# EAGLE schematic Control board (EAGLE 9.6.2)
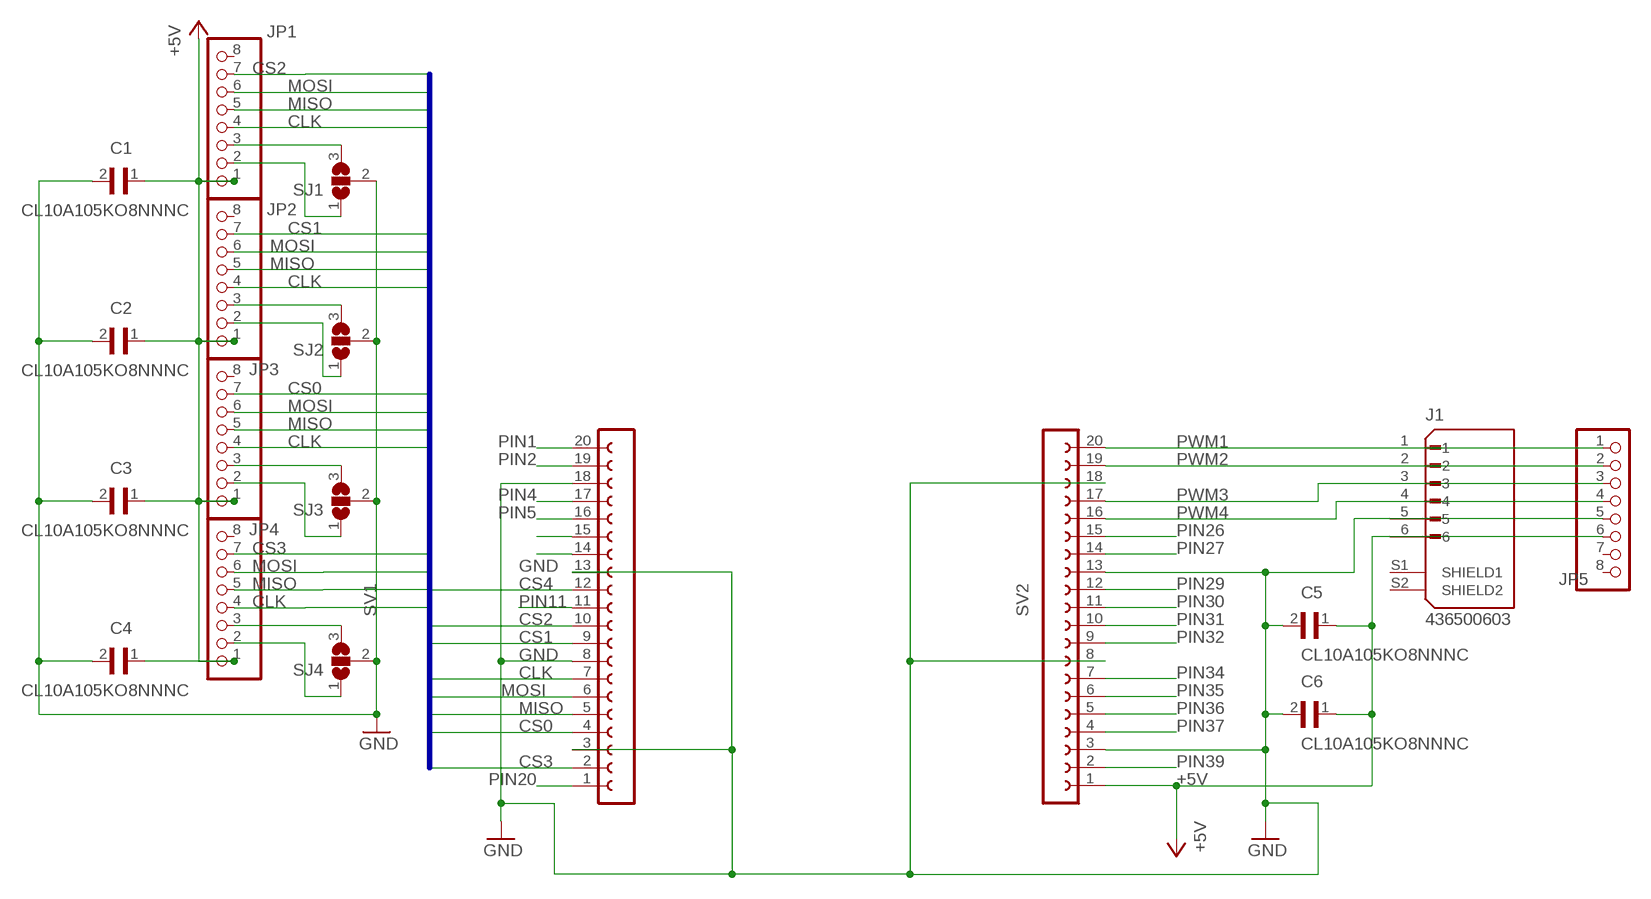
[diagram p0: schematic, sheet 1]

## Parts
C1  CL10A105KO8NNNC  [CAPC1608X90N]
C2  CL10A105KO8NNNC  [CAPC1608X90N]
C3  CL10A105KO8NNNC  [CAPC1608X90N]
C4  CL10A105KO8NNNC  [CAPC1608X90N]
C5  CL10A105KO8NNNC  [CAPC1608X90N]
C6  CL10A105KO8NNNC  [CAPC1608X90N]
J1  436500603  [MOLEX_436500603]
JP1  PINHD-1X81X08/FE  [HDRVR8W64P254_1X8_2159X200X810B]
JP2  PINHD-1X81X08/FE  [HDRVR8W64P254_1X8_2159X200X810B]
JP3  PINHD-1X81X08/FE  [HDRVR8W64P254_1X8_2159X200X810B]
JP4  PINHD-1X81X08/FE  [HDRVR8W64P254_1X8_2159X200X810B]
JP5  PINHD-1X81X08/FE  [HDRVR8W64P254_1X8_2159X200X810B]
SJ1  SJ2W  [SJ_2]
SJ2  SJ2W  [SJ_2]
SJ3  SJ2W  [SJ_2]
SJ4  SJ2W  [SJ_2]
SV1  FE20-1  [FE20]
SV2  FE20-1  [FE20]

## Nets
+5V: C1.1 C2.1 C3.1 C4.1 C5.1 C6.1 J1.6 JP1.1 JP2.1 JP3.1 JP4.1 JP5.6 SV2.1
CLK: JP1.4 JP2.4 JP3.4 JP4.4 SV1.7
CS0: JP3.7 SV1.4
CS1: JP2.7 SV1.9
CS2: JP1.7 SV1.10
CS3: JP4.7 SV1.2
CS4: SV1.12
GND: C1.2 C2.2 C3.2 C4.2 C5.2 C6.2 J1.5 JP5.5 SJ1.2 SJ2.2 SJ3.2 SJ4.2 SV1.3 SV1.8 SV1.13 SV1.18 SV2.3 SV2.8 SV2.13 SV2.18
MISO: JP1.5 JP2.5 JP3.5 JP4.5 SV1.5
MOSI: JP1.6 JP2.6 JP3.6 JP4.6 SV1.6
N$1: SV1.15
N$2: SV1.14
N$3: JP4.2 SJ4.1
N$4: JP1.3 SJ1.3
N$5: JP1.2 SJ1.1
N$6: JP2.3 SJ2.3
N$7: JP2.2 SJ2.1
N$8: JP3.3 SJ3.3
N$9: JP3.2 SJ3.1
N$10: JP4.3 SJ4.3
PIN1: SV1.20
PIN2: SV1.19
PIN4: SV1.17
PIN5: SV1.16
PIN11: SV1.11
PIN20: SV1.1
PIN26: SV2.15
PIN27: SV2.14
PIN29: SV2.12
PIN30: SV2.11
PIN31: SV2.10
PIN32: SV2.9
PIN34: SV2.7
PIN35: SV2.6
PIN36: SV2.5
PIN37: SV2.4
PIN39: SV2.2
PWM1: J1.1 JP5.1 SV2.20
PWM2: J1.2 JP5.2 SV2.19
PWM3: J1.3 JP5.3 SV2.17
PWM4: J1.4 JP5.4 SV2.16
Unconnected: J1.S1(SHIELD1) J1.S2(SHIELD2) JP1.8 JP2.8 JP3.8 JP4.8 JP5.7 JP5.8

## Buses
SPI:CLK,CS[0..5],MISO,MOSI

## Library data of the parts
C1-C6 = SnapEDA Library:CL10A105KO8NNNC
J1 = SnapEDA Library:436500603; MANUFACTURER: Molex; MAXIMUM_PACKAGE_HEIGHT: 5.57 mm; PARTREV: F3; STANDARD: Manufacturer Recommendations
JP1-JP5 = pinhead:PINHD-1X8: PIN HEADER
SJ1-SJ4 = jumper:SJ2W: SMD solder JUMPER
SV1 SV2 = con-lsta:FE20-1: FEMALE HEADER; OC_FARNELL: unknown; OC_NEWARK: unknown

## Net classes
0 default: clearance 0.205 mm